# EAGLE schematic wifiweatherguy (EAGLE 7.5.0)
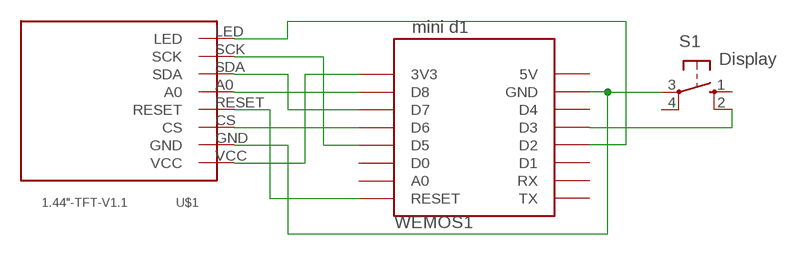
[diagram p0: schematic, sheet 1]

## Parts
S1  Display  10-XX  [B3F-10XX]
U$1  1.44"-TFT-V1.1  [1.44-TFT-V1.1]
WEMOS1  mini d1  WEMOS-D1-MINI  [WEMOS-D1-MINI]

## Nets
N$1: U$1.VCC WEMOS1.3V3
N$2: U$1.CS WEMOS1.D6
N$3: U$1.A0 WEMOS1.D8
N$4: U$1.SDA WEMOS1.D7
N$5: U$1.SCK WEMOS1.D5
N$6: U$1.LED WEMOS1.D2
N$7: S1.3(P) U$1.GND WEMOS1.GND
N$8: U$1.RESET WEMOS1.RESET
N$9: S1.2(S1) WEMOS1.D3
Unconnected: S1.1(S) S1.4(P1) WEMOS1.5V WEMOS1.A0 WEMOS1.D0 WEMOS1.D1 WEMOS1.D4 WEMOS1.RX WEMOS1.TX

## Library data of the parts
S1 = switch-omron:10-XX: OMRON SWITCH; MPN: B3F-1000; OC_FARNELL: 176432; OC_NEWARK: 36M3542
U$1 = tft_1.8_1.44_oled_0.96:1.44"-TFT-V1.1
WEMOS1 = esp8266modules:WEMOS-D1-MINI: WeMos.cc D1 mini ESP8266 module